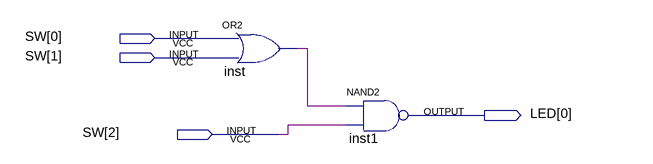
[diagram p0: schematic sheet]
// Quartus schematic lab1ex2.bdf as structural Verilog: 2 symbols, 4 pins
module lab1ex2 (
  input  [2:0] SW,
  output [0:0] LED
);

  wire inst_out;

  or inst (inst_out, SW[0], SW[1]);
  nand inst1 (LED[0], inst_out, SW[2]);
endmodule
